# EAGLE schematic BC127 (EAGLE 9.6.2)
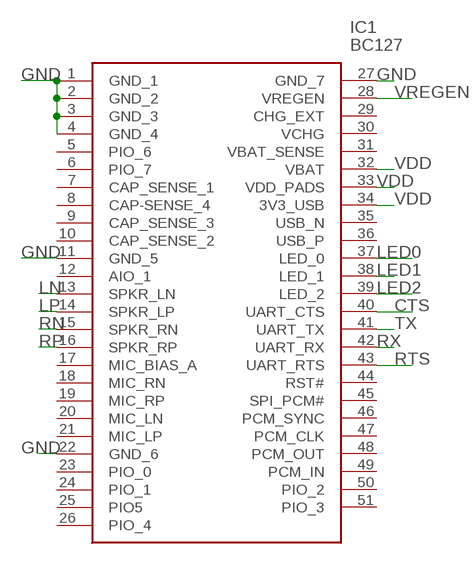
[diagram p0: schematic, sheet 1]

## Parts
IC1  BC127  [BC127_3]

## Nets
CTS: IC1.40(UART_CTS)
GND: IC1.1(GND_1) IC1.2(GND_2) IC1.3(GND_3) IC1.4(GND_4) IC1.11(GND_5) IC1.22(GND_6) IC1.27(GND_7)
LED0: IC1.37(LED_0)
LED1: IC1.38(LED_1)
LED2: IC1.39(LED_2)
LN: IC1.13(SPKR_LN)
LP: IC1.14(SPKR_LP)
RN: IC1.15(SPKR_RN)
RP: IC1.16(SPKR_RP)
RTS: IC1.43(UART_RTS)
RX: IC1.42(UART_RX)
TX: IC1.41(UART_TX)
VDD: IC1.32(VBAT) IC1.33(VDD_PADS) IC1.34(3V3_USB)
VREGEN: IC1.28(VREGEN)
Unconnected: IC1.5(PIO_6) IC1.6(PIO_7) IC1.7(CAP_SENSE_1) IC1.8(CAP-SENSE_4) IC1.9(CAP_SENSE_3) IC1.10(CAP_SENSE_2) IC1.12(AIO_1) IC1.17(MIC_BIAS_A) IC1.18(MIC_RN) IC1.19(MIC_RP) IC1.20(MIC_LN) IC1.21(MIC_LP) IC1.23(PIO_0) IC1.24(PIO_1) IC1.25(PIO5) IC1.26(PIO_4) IC1.29(CHG_EXT) IC1.30(VCHG) IC1.31(VBAT_SENSE) IC1.35(USB_N) IC1.36(USB_P) IC1.44(RST#) IC1.45(SPI_PCM#) IC1.46(PCM_SYNC) IC1.47(PCM_CLK) IC1.48(PCM_OUT) IC1.49(PCM_IN) IC1.50(PIO_2) IC1.51(PIO_3)

## Library data of the parts
IC1 = bc127:BC127: Bluetooth Certified 4.0 Audio module (11.8mm x 18mm x 3.2mm), 51 pin, surface mounted Source: Datasheet <https://www.bluecreation.com/fdownload.php?file=bc127-datasht-009-1467380980.pdf>; DESCRIPTION: Bluetooth Certified 4.0 Audio module (11.8mm x 18mm x 3.2mm), 51 pin, surface mounted; HEIGHT: mm; MANUFACTURER_NAME: Blue Creation; MANUFACTURER_PART_NUMBER: bc127